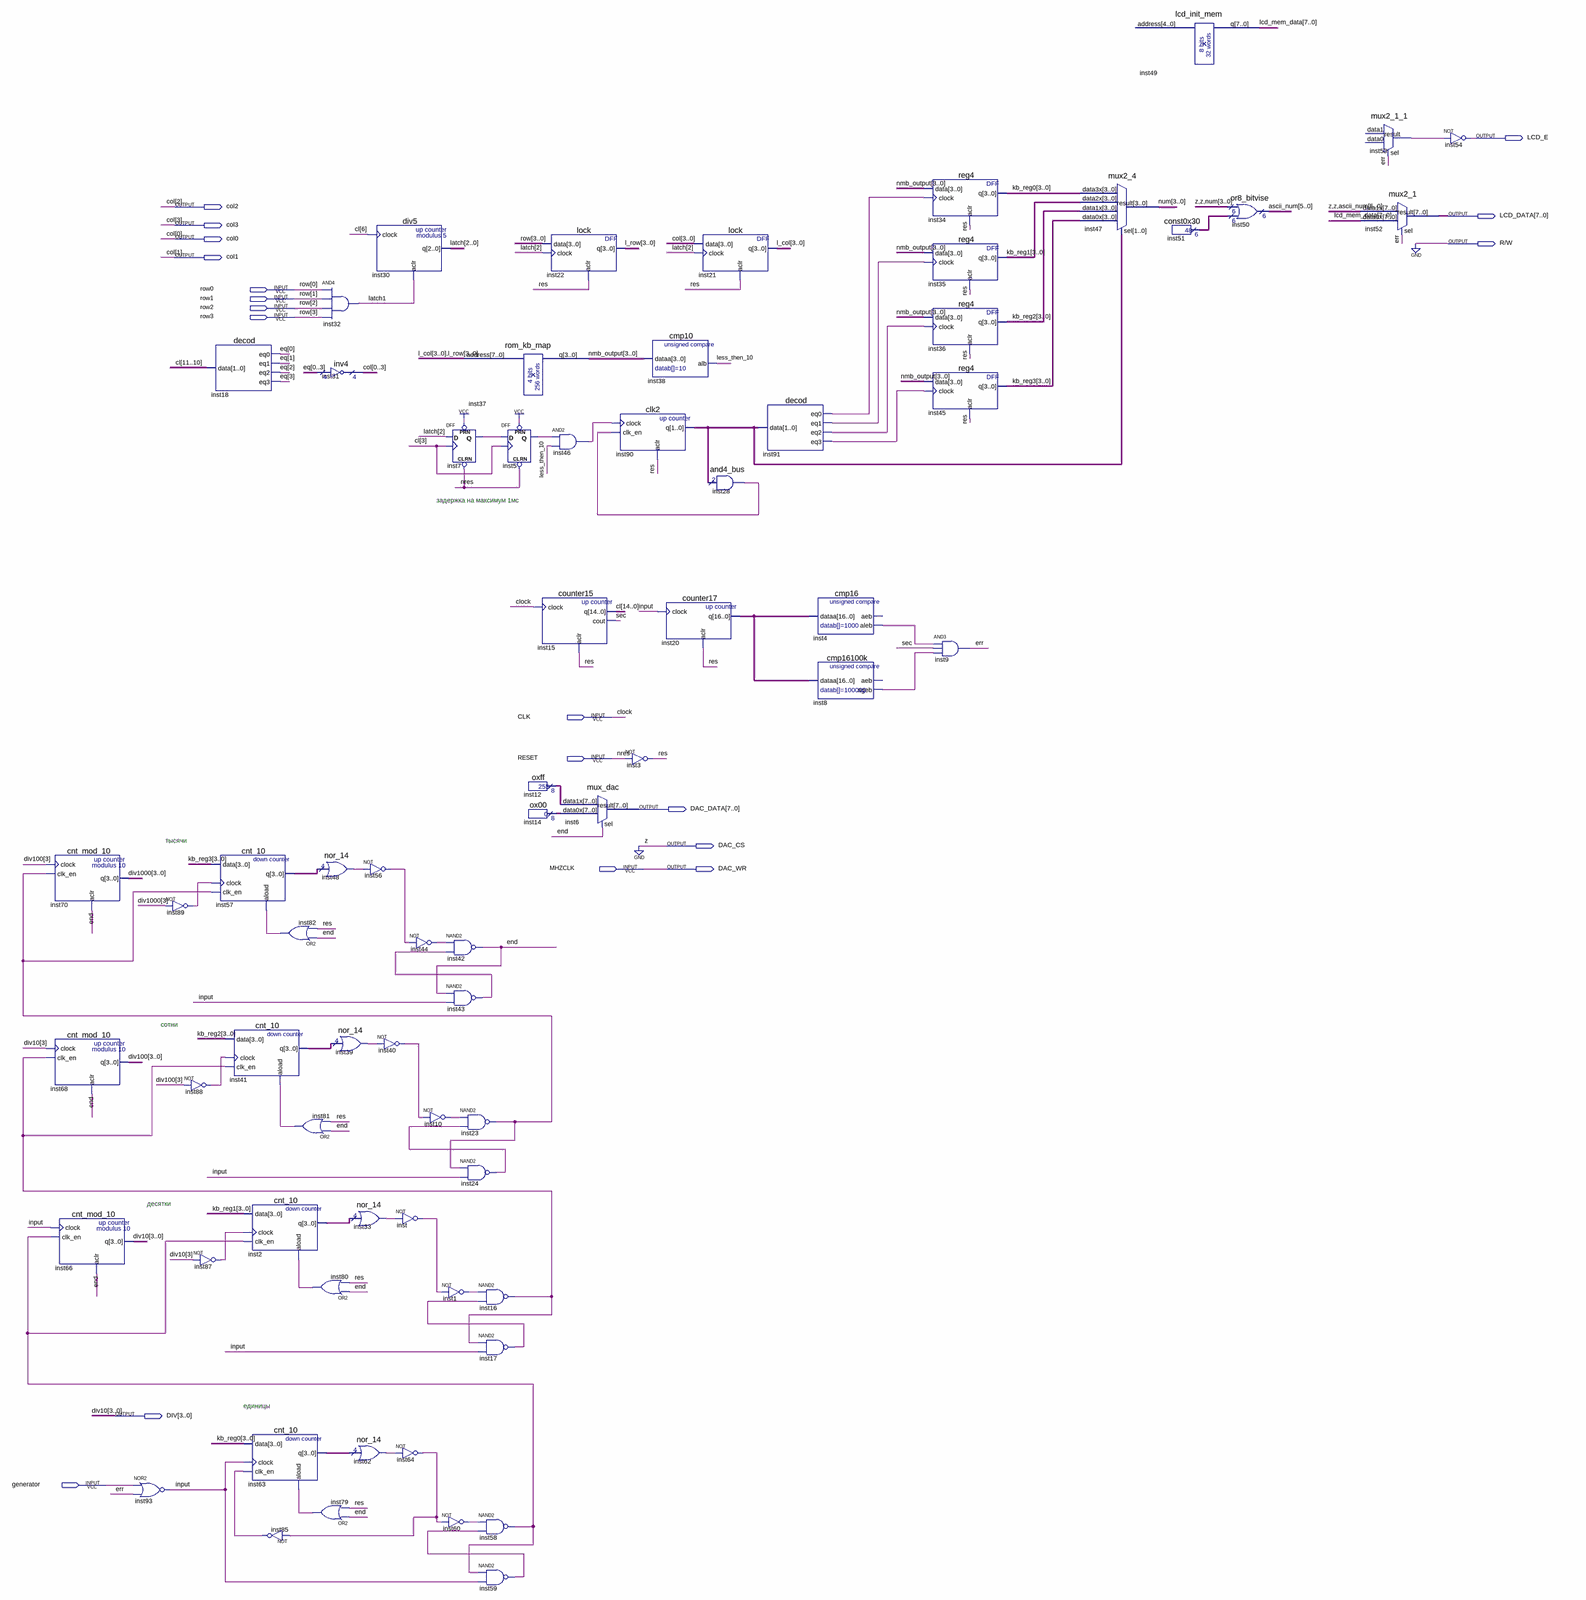
[diagram p0: schematic sheet, whole]
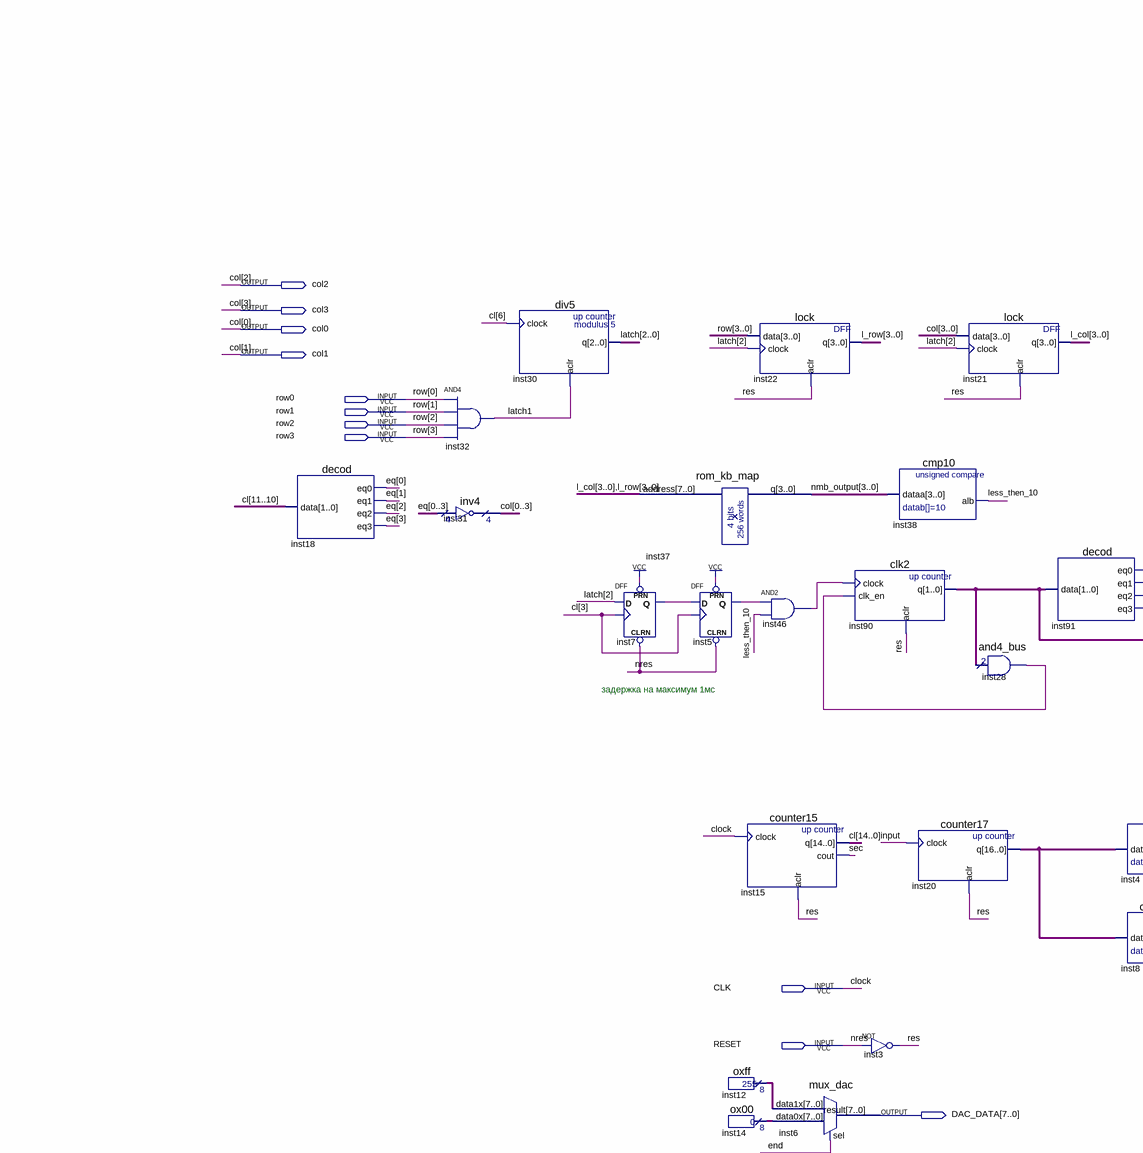
[diagram p1: schematic sheet, upper left part]
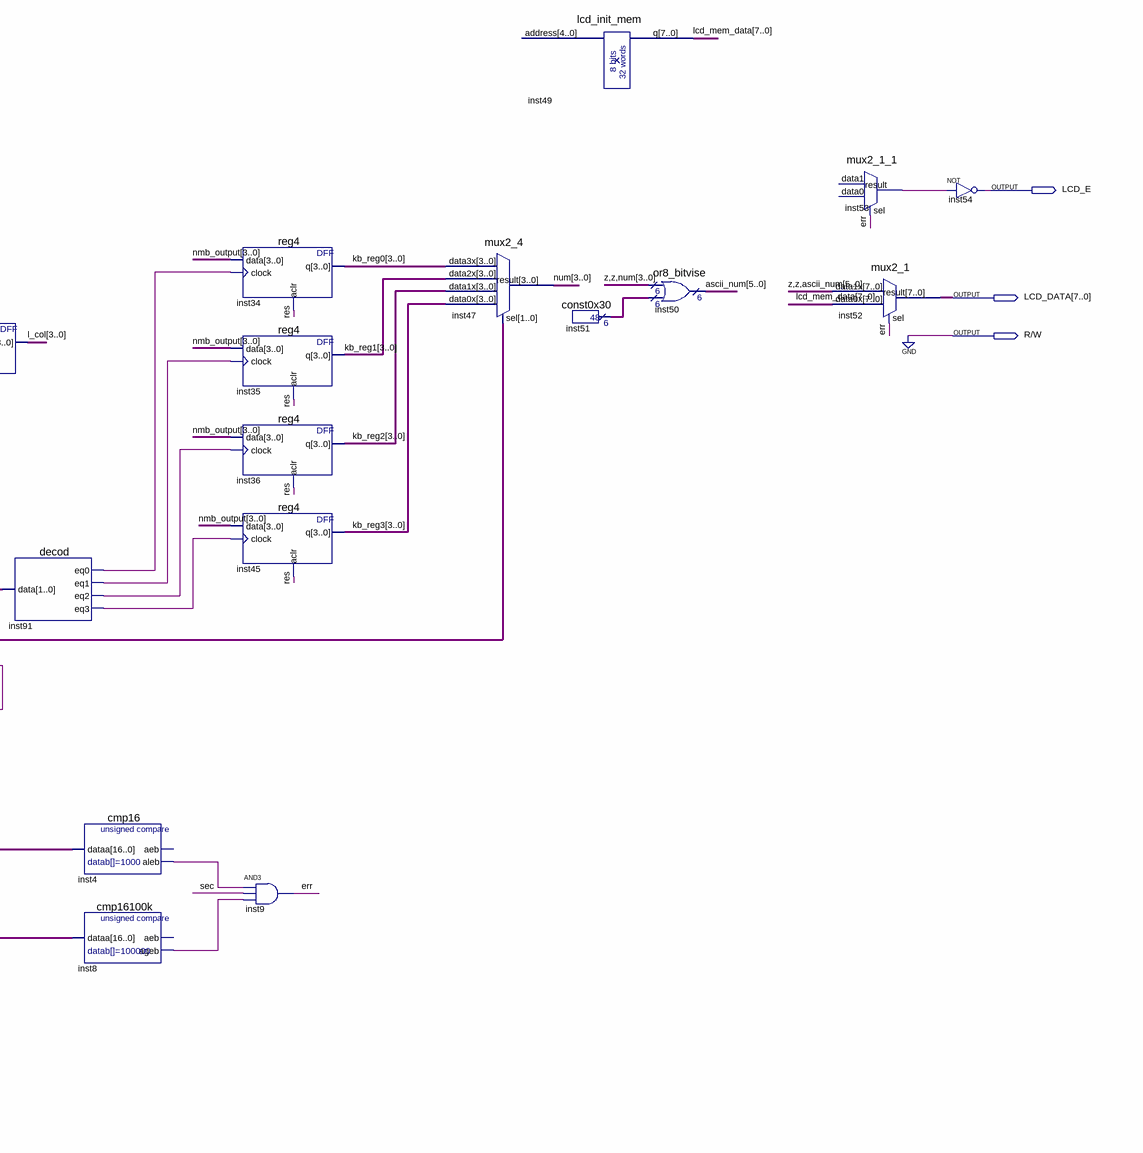
[diagram p2: schematic sheet, upper right part]
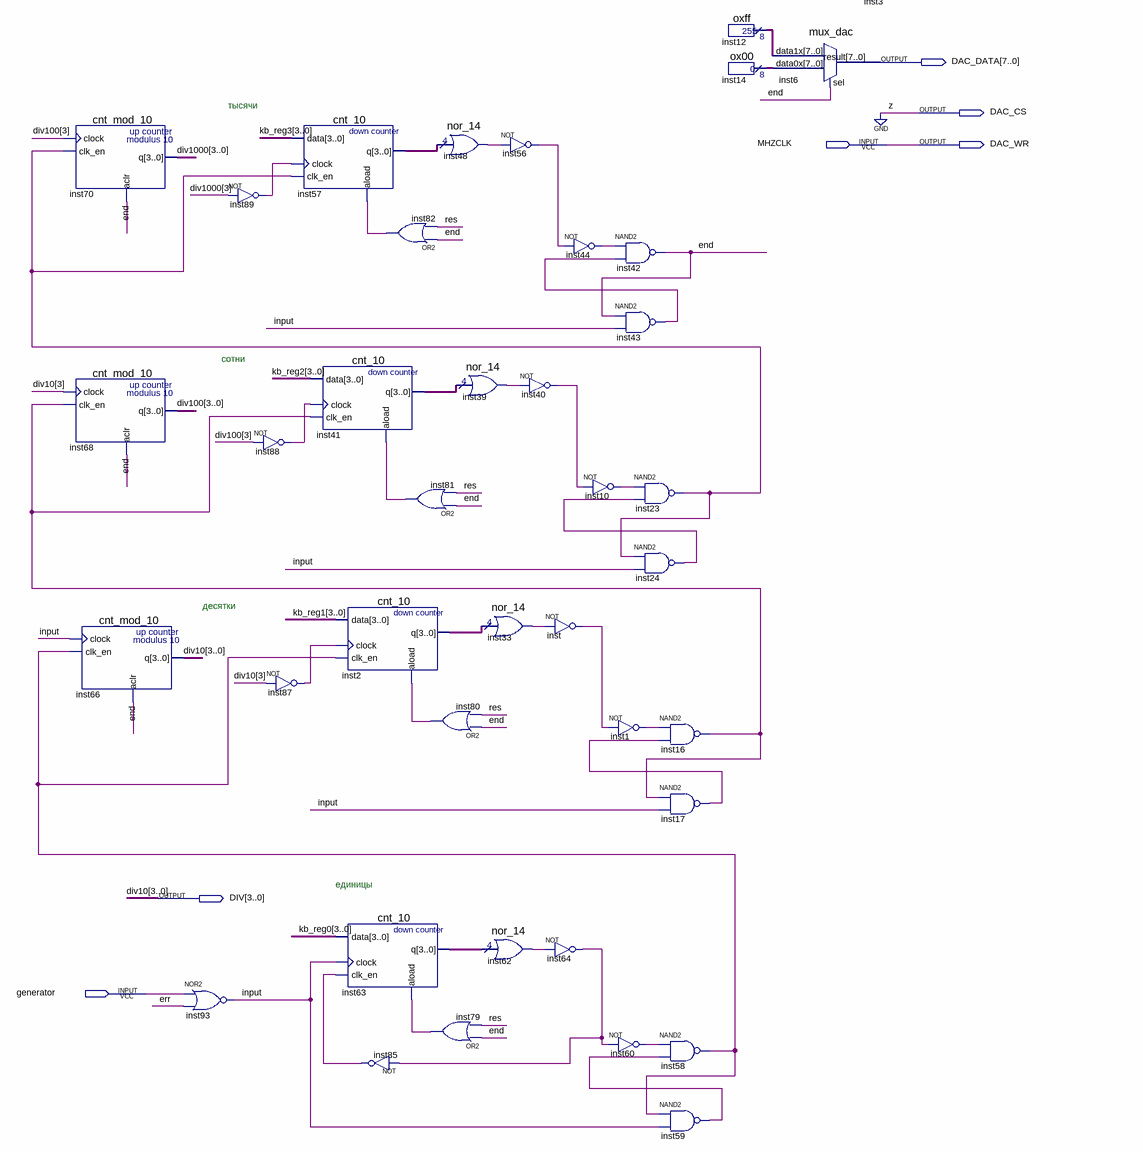
[diagram p3: schematic sheet, lower left part]
// Quartus schematic course_project.bdf as structural Verilog: 70 symbols, 19 pins
module course_project (
  input  row0,
  input  row1,
  input  row2,
  input  row3,
  input  CLK,
  input  RESET,
  input  MHZCLK,
  input  generator,
  output LCD_E,
  output col2,
  output [7:0] LCD_DATA,
  output col3,
  output col0,
  output \R/W ,
  output col1,
  output [7:0] DAC_DATA,
  output DAC_CS,
  output DAC_WR,
  output [3:0] DIV
);

  wire \end , err, \input , inst1_out, inst4_aleb, inst5_q, inst7_q, inst8_ageb, inst10_out, inst16_out,
       inst17_out, inst23_out, inst24_out, inst28_result, inst33_result, inst39_result, inst40_out,
       inst43_out, inst44_out, inst46_out, inst48_result, inst53_result, inst56_out, inst58_out, inst59_out,
       inst60_out, inst62_result, inst64_out, inst79_out, inst80_out, inst81_out, inst82_out, inst85_out,
       inst87_out, inst88_out, inst89_out, inst91_eq0, inst91_eq1, inst91_eq2, inst91_eq3, inst_out,
       less_then_10, res, sec;
  wire [1:0] inst90_q;
  wire [2:0] latch;
  wire [3:0] div100, div1000, eq, inst2_q, inst41_q, inst57_q, inst63_q, kb_reg0, kb_reg1, kb_reg2, kb_reg3,
       l_col, l_row, nmb_output, num;
  wire [5:0] ascii_num, inst51_result;
  wire [7:0] inst12_result, inst14_result, lcd_mem_data;
  wire [14:0] cl;
  wire [16:0] inst20_q;

  cnt_mod_10 inst70 (.clock(div100[3]), .clk_en(inst23_out), .aclr(\end ), .q(div1000));
  cnt_mod_10 inst68 (.clock(DIV[3]), .clk_en(inst16_out), .aclr(\end ), .q(div100));
  cnt_mod_10 inst66 (.clock(\input ), .clk_en(inst58_out), .aclr(\end ), .q(DIV));
  nor inst93 (\input , generator, err);
  not inst89 (inst89_out, div1000[3]);
  not inst88 (inst88_out, div100[3]);
  not inst87 (inst87_out, DIV[3]);
  decod inst18 (.data(cl[11:10]), .eq0(eq[0]), .eq1(eq[1]), .eq2(eq[2]), .eq3(eq[3]));
  cnt_10 inst57 (.data(kb_reg3), .clock(inst89_out), .clk_en(inst23_out), .aload(inst82_out), .q(inst57_q));
  cnt_10 inst41 (.data(kb_reg2), .clock(inst88_out), .clk_en(inst16_out), .aload(inst81_out), .q(inst41_q));
  cnt_10 inst2 (.data(kb_reg1), .clock(inst87_out), .clk_en(inst58_out), .aload(inst80_out), .q(inst2_q));
  cnt_10 inst63 (.data(kb_reg0), .clock(\input ), .clk_en(inst85_out), .aload(inst79_out), .q(inst63_q));
  not inst85 (inst85_out, inst64_out);
  or inst82 (inst82_out, \end , res);
  or inst81 (inst81_out, \end , res);
  and inst32 (latch[1], row0, row1, row2, row3);
  inv4 inst31 (.data({eq[0], eq[1], eq[2], eq[3]}), .result({col0, col1, col2, col3}));
  nor_14 inst48 (.data(inst57_q), .result(inst48_result));
  nor_14 inst39 (.data(inst41_q), .result(inst39_result));
  or inst80 (inst80_out, \end , res);
  or inst79 (inst79_out, \end , res);
  div5 inst30 (.clock(cl[6]), .aclr(latch[1]), .q(latch));
  not inst56 (inst56_out, inst48_result);
  not inst40 (inst40_out, inst39_result);
  nor_14 inst33 (.data(inst2_q), .result(inst33_result));
  nor_14 inst62 (.data(inst63_q), .result(inst62_result));
  not inst44 (inst44_out, inst56_out);
  not inst (inst_out, inst33_result);
  not inst64 (inst64_out, inst62_result);
  DFF inst7 (.CLRN(RESET), .CLK(cl[3]), .D(latch[2]), .PRN(1'b1), .Q(inst7_q));
  nand inst42 (\end , inst44_out, inst43_out);
  nand inst43 (inst43_out, \end , \input );
  not inst10 (inst10_out, inst40_out);
  not inst1 (inst1_out, inst_out);
  not inst60 (inst60_out, inst64_out);
  rom_kb_map inst37 (.address({l_col, l_row}), .q(nmb_output));
  nand inst23 (inst23_out, inst10_out, inst24_out);
  nand inst24 (inst24_out, inst23_out, \input );
  nand inst16 (inst16_out, inst1_out, inst17_out);
  nand inst17 (inst17_out, inst16_out, \input );
  nand inst58 (inst58_out, inst60_out, inst59_out);
  nand inst59 (inst59_out, inst58_out, \input );
  DFF inst5 (.CLRN(RESET), .CLK(cl[3]), .D(inst7_q), .PRN(1'b1), .Q(inst5_q));
  oxff inst12 (.result(inst12_result));
  ox00 inst14 (.result(inst14_result));
  lock inst22 (.data({row3, row2, row1, row0}), .clock(latch[2]), .aclr(res), .q(l_row));
  and inst46 (inst46_out, inst5_q, less_then_10);
  counter15 inst15 (.clock(CLK), .aclr(res), .q(cl), .cout(sec));
  mux_dac inst6 (.data1x(inst12_result), .data0x(inst14_result), .sel(\end ), .result(DAC_DATA));
  clk2 inst90 (.clock(inst46_out), .clk_en(inst28_result), .aclr(res), .q(inst90_q));
  not inst3 (res, RESET);
  cmp10 inst38 (.dataa(nmb_output), .alb(less_then_10));
  counter17 inst20 (.clock(\input ), .aclr(res), .q(inst20_q));
  lock inst21 (.data({col3, col2, col1, col0}), .clock(latch[2]), .aclr(res), .q(l_col));
  and4_bus inst28 (.data(inst90_q), .result(inst28_result));
  decod inst91 (.data(inst90_q), .eq0(inst91_eq0), .eq1(inst91_eq1), .eq2(inst91_eq2), .eq3(inst91_eq3));
  cmp16 inst4 (.dataa(inst20_q), .aleb(inst4_aleb));  // open: aeb
  cmp16100k inst8 (.dataa(inst20_q), .ageb(inst8_ageb));  // open: aeb
  reg4 inst34 (.data(nmb_output), .clock(inst91_eq0), .aclr(res), .q(kb_reg0));
  reg4 inst35 (.data(nmb_output), .clock(inst91_eq1), .aclr(res), .q(kb_reg1));
  reg4 inst36 (.data(nmb_output), .clock(inst91_eq2), .aclr(res), .q(kb_reg2));
  reg4 inst45 (.data(nmb_output), .clock(inst91_eq3), .aclr(res), .q(kb_reg3));
  and inst9 (err, inst4_aleb, sec, inst8_ageb);
  mux2_4 inst47 (.data3x(kb_reg0), .data2x(kb_reg1), .data1x(kb_reg2), .data0x(kb_reg3), .sel(inst90_q), .result(num));
  lcd_init_mem inst49 (.q(lcd_mem_data));  // open: address
  const0x30 inst51 (.result(inst51_result));
  or8_bitvise inst50 (.data0x({2'b00, num}), .data1x(inst51_result), .result(ascii_num));
  mux2_1_1 inst53 (.sel(err), .result(inst53_result));  // open: data1, data0
  mux2_1 inst52 (.data1x({2'b00, ascii_num}), .data0x(lcd_mem_data), .sel(err), .result(LCD_DATA));
  not inst54 (LCD_E, inst53_result);

  assign DAC_CS = 1'b0;
  assign DAC_WR = MHZCLK;
  assign \R/W  = 1'b0;

  // Other names for the same wires on the sheet: clock = CLK; div10[3:0] = DIV; nres = RESET

  // Notes on the sheet:
  //   задержка на максимум 1мс
  //   тысячи
  //   сотни
  //   десятки
  //   единицы
endmodule
